# EAGLE design ArduinoRadioV1 (EAGLE 9.5.2)
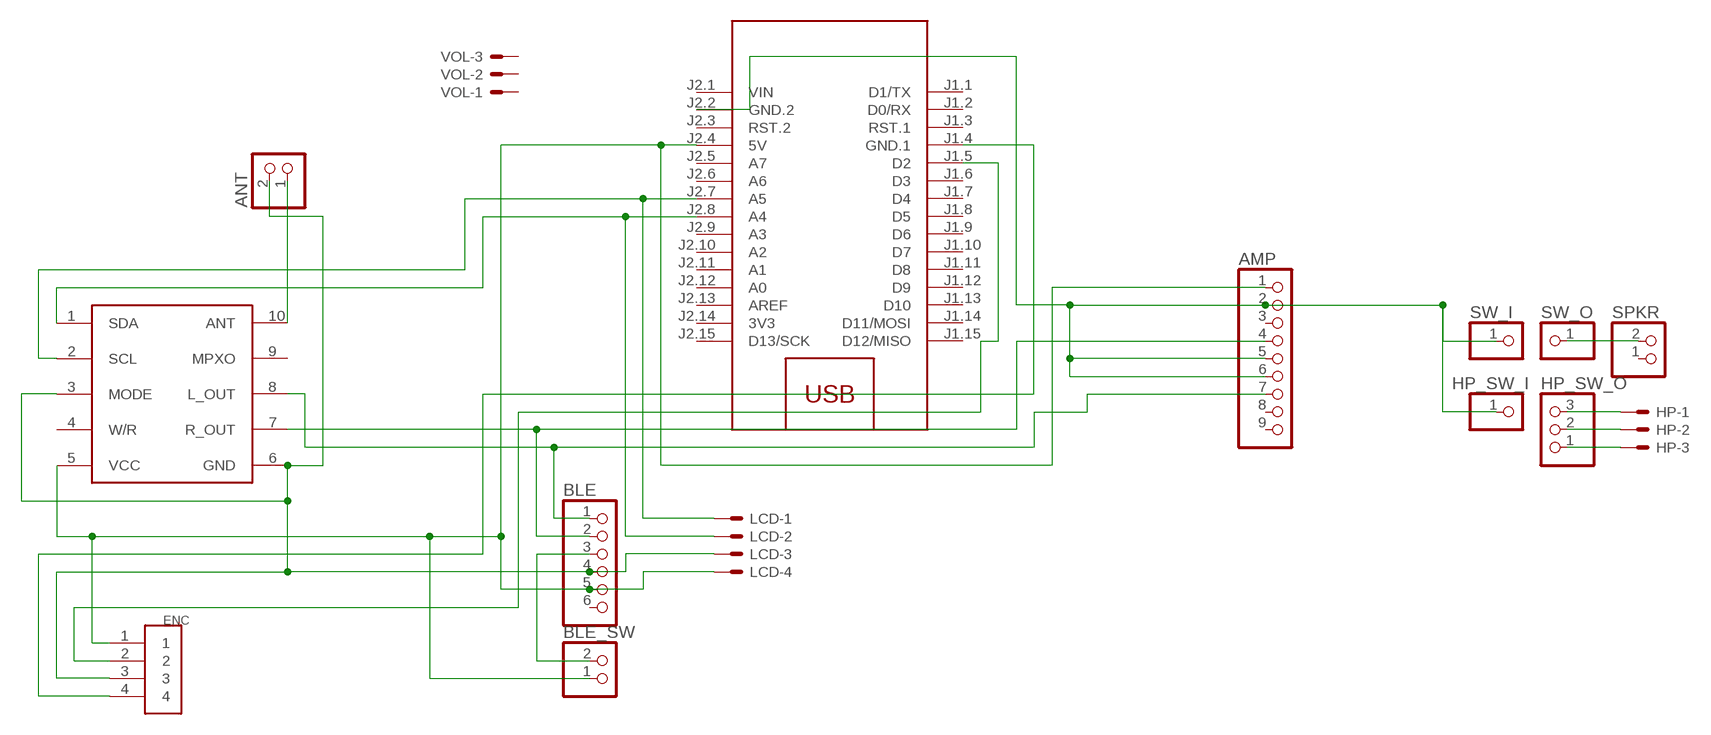
[diagram p0: schematic, sheet 1]

## Parts
AMP  PINHD-1X9  [1X09-BIG]
ANT  JST_2PIN-THM  [JST-PH-2-THM]
BLE  PINHD-1X6  [1X06]
BLE_SW  JST_2PIN-THM  [JST-PH-2-THM]
ENC  1X4-BIG  [1X04-BIG]
HP  JST-XH-03-PIN-ROUND-PAD  [JST-XH-03-PACKAGE-ROUND-PAD]
HP_SW_I  PINHD-1X1  [1X01]
HP_SW_O  PINHD-1X3  [1X03]
LCD  JST-XH-04-PIN-ROUND-PAD  [JST-XH-04-PACKAGE-ROUND-PAD]
M1  ARDUINO-NANO-3.0  [ARDUINO-NANO-3.0]
SPKR  JST_2PIN-THM  [JST-PH-2-THM]
SW_I  PINHD-1X1  [1X01]
SW_O  PINHD-1X1  [1X01]
TEA5767  TEA5767BREAKOUT  [TEA5767MM2]
VOL  JST-XH-03-PIN-ROUND-PAD  [JST-XH-03-PACKAGE-ROUND-PAD]

## Nets
ANT: ANT.1 TEA5767.10(ANT)
D2: ENC.2 M1.J1.5(D2)
GND: ANT.2 BLE.4 ENC.3 LCD.3 TEA5767.3(MODE) TEA5767.6(GND)
HP_GND: HP.1 HP_SW_O.3
L: HP.3 HP_SW_O.1
L_OUT: AMP.7 BLE.1 TEA5767.8(L_OUT)
N$1: SPKR.2 SW_O.1
N$2: BLE.3 BLE_SW.2
N$6: ENC.4 M1.J1.4(GND.1)
R: HP.2 HP_SW_O.2
R_OUT: AMP.2 AMP.4 AMP.5 AMP.6 BLE.2 HP_SW_I.1 M1.J2.2(GND.2) SW_I.1 TEA5767.7(R_OUT)
SCL: LCD.1 M1.J2.7(A5) TEA5767.2(SCL)
SDA: LCD.2 M1.J2.8(A4) TEA5767.1(SDA)
VCC: AMP.1 BLE.5 BLE_SW.1 ENC.1 LCD.4 M1.J2.4(5V) TEA5767.5(VCC)
Unconnected: AMP.3 AMP.8 AMP.9 BLE.6 M1.J1.1(D1/TX) M1.J1.2(D0/RX) M1.J1.3(RST.1) M1.J1.6(D3) M1.J1.7(D4) M1.J1.8(D5) M1.J1.9(D6) M1.J1.10(D7) M1.J1.11(D8) M1.J1.12(D9) M1.J1.13(D10) M1.J1.14(D11/MOSI) M1.J1.15(D12/MISO) M1.J2.3(RST.2) M1.J2.5(A7) M1.J2.6(A6) M1.J2.9(A3) M1.J2.10(A2) M1.J2.11(A1) M1.J2.12(A0) M1.J2.13(AREF) M1.J2.15(D13/SCK) SPKR.1 TEA5767.4(W/R) TEA5767.9(MPXO) VOL.1 VOL.2 VOL.3

## Power pins joined to a net without a drawn wire
3V3: M1.J2.14(3V3)
VIN: M1.J2.1(VIN)

## Library data of the parts
AMP = adafruit:PINHD-1X9: Pin header 1x10 0.1" spacing With round pins
ANT BLE_SW SPKR = adafruit:JST_2PIN: JST 2-Pin Connectors of various flavors SMT-RA (S2B-PH-SM4) 4UConnector #17311 SMT (B2B-PH-SM4) THM-RA (S2B-PH) THM (B2B-PH)
BLE = adafruit:PINHD-1X6: PIN HEADER
ENC = adafruit:1X4: 4-pin connector
HP VOL = Rembrandt Electronics - JST XH Connectors v1-0:JST-XH-03-PIN: JST XH Connector 2 Pin Wire to board connector. Pitch: 2,54 mm, (0.100") Number of pins: 3 Created by Rembrandt Electronics www.rembrandtelectronics.com
HP_SW_I SW_I SW_O = adafruit:PINHD-1X1: Pin header 1x1 for 0.1" spacing With round pins
HP_SW_O = adafruit:PINHD-1X3: PIN HEADER
LCD = Rembrandt Electronics - JST XH Connectors v1-0:JST-XH-04-PIN: JST XH Connector 2 Pin Wire to board connector. Pitch: 2,54 mm, (0.100") Number of pins: 4 Created by Rembrandt Electronics www.rembrandtelectronics.com
M1 = diy-modules:ARDUINO-NANO-3.0: Arduino Nano 3.0 and compatible devices More details available here: https://www.arduino.cc/en/Main/ArduinoBoardNano Click here to find device on ebay.com <http://www.ebay.com/sch/arduino+nano>
TEA5767 = MyParts:TEA5767BREAKOUT

## Board
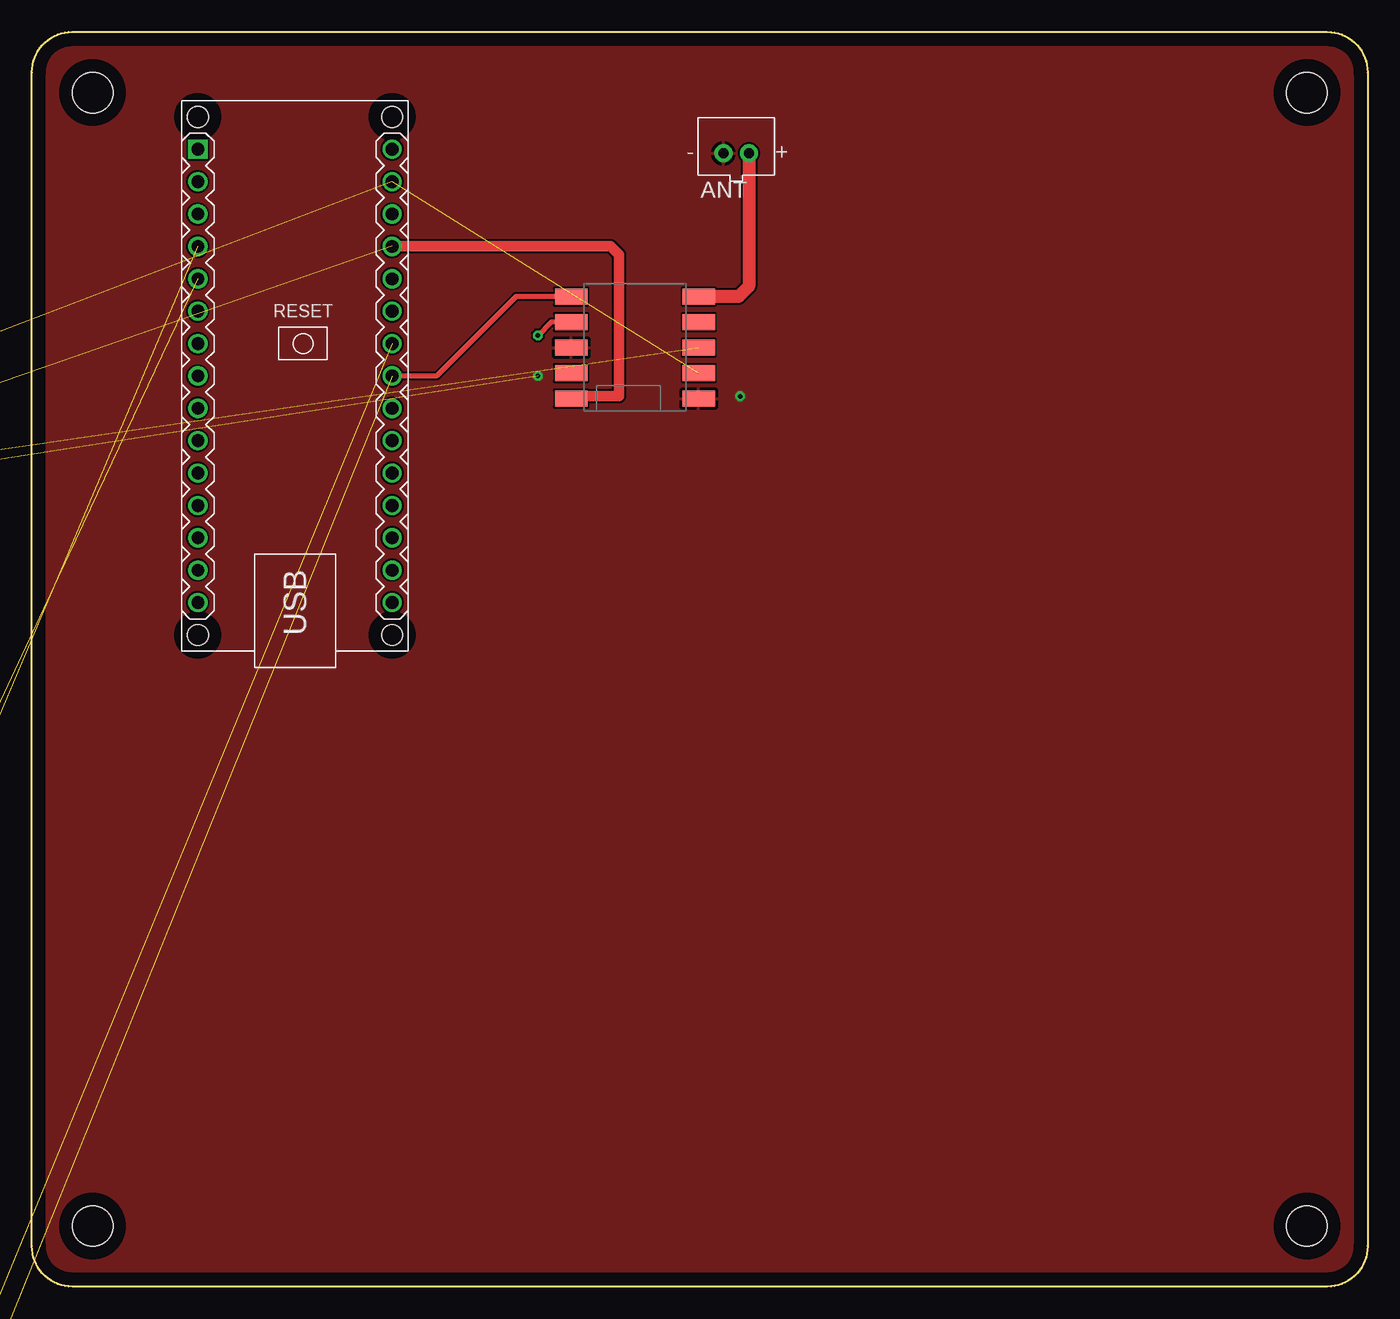
[diagram p1: board, top side]
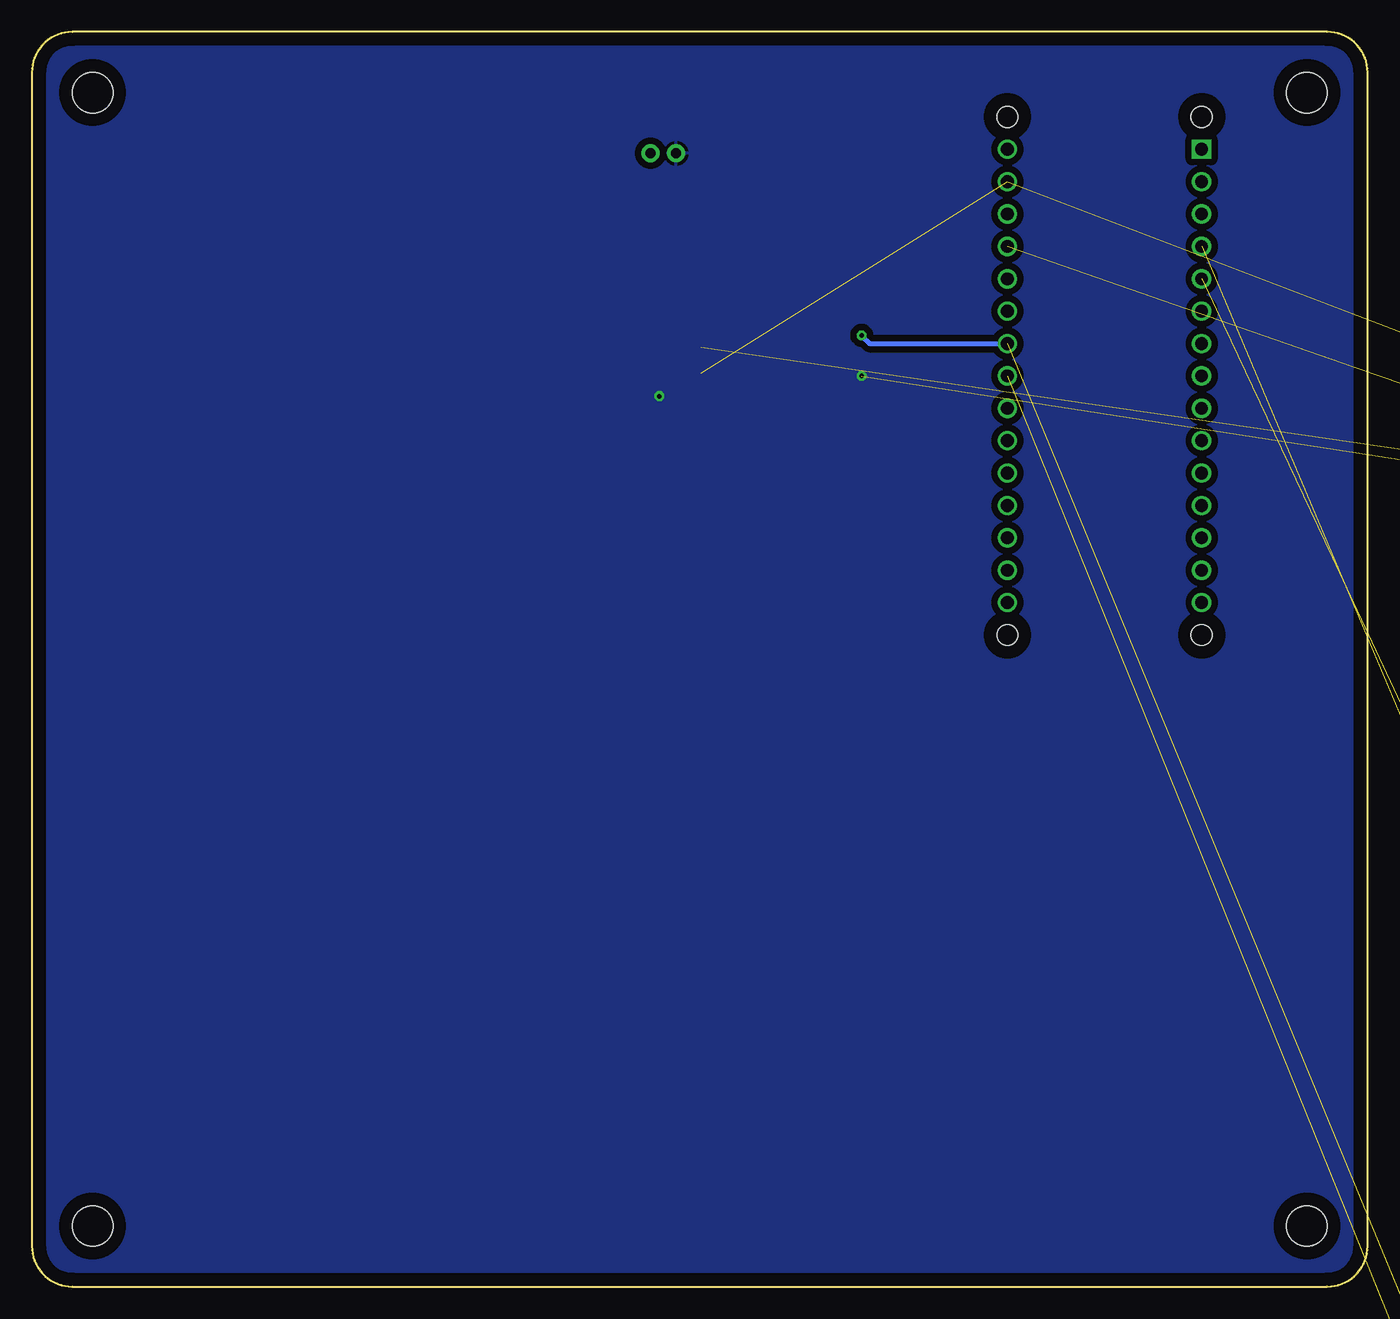
[diagram p2: board, bottom side, seen from below]

Size 104.78 x 98.42 mm. Coordinates in mm from the lower left corner, seen from the top.
Outline: 101.6,0 3.17,0 arc-90 0,3.18 0,95.25 arc-90 3.17,98.43 101.6,98.43 arc-90 104.78,95.25 104.78,3.18 arc-90 101.6,0
Copper layers (1*16): Top 0.035mm / dielectric 1.5mm / Bottom 0.035mm
Design rules "default": minimum track width 6mil, minimum drill 0.35mm, track to track 6mil, track to pad 6mil, pad to pad 6mil, via to via 6mil, smd to smd 6mil, copper to edge 40mil, drill to drill 6mil, minimum pad ring 10mil, minimum via ring 8mil, stop-mask expansion 4mil, vias tented up to drill 0mil, thermal gap 10mil
Holes 3.17 mm at 4.76,4.76 100.01,4.76 4.76,93.66 100.01,93.66

### Footprints (pad centres in the part's own frame; a part is rotated, then mirrored left to right if it is on the bottom)
1X09-BIG = drill 1.016 pad 1.778 octagon: 1 -10.16,0; 2 -7.62,0; 3 -5.08,0; 4 -2.54,0; 5 0,0; 6 2.54,0; 7 5.08,0; 8 7.62,0; 9 10.16,0
JST-PH-2-THM = drill 0.8 pad 1.422: 1 1,0; 2 -1,0
1X06 = drill 1.016 octagon: 1 -6.35,0; 2 -3.81,0; 3 -1.27,0; 4 1.27,0; 5 3.81,0; 6 6.35,0
1X04-BIG = drill 1.016 pad 1.778: 1 0,0; 2 2.54,0; 3 5.08,0; 4 7.62,0
JST-XH-03-PACKAGE-ROUND-PAD = drill 1.016: 1 -2.54,0; 2 0,0; 3 2.54,0
1X01 = drill 1.016 pad 1.93 octagon: 1 0,0
1X03 = drill 1.016: 1 -2.54,0; 2 0,0; 3 2.54,0
JST-XH-04-PACKAGE-ROUND-PAD = drill 1.016: 1 -3.81,0; 2 -1.27,0; 3 1.27,0; 4 3.81,0
ARDUINO-NANO-3.0 = drill 1 square: J1.1 17.78,7.62 | drill 1: J1.2 15.24,7.62; J1.3 12.7,7.62; J1.4 10.16,7.62; J1.5 7.62,7.62; J1.6 5.08,7.62; J1.7 2.54,7.62; J1.8 0,7.62; J1.9 -2.54,7.62; J1.10 -5.08,7.62; J1.11 -7.62,7.62; J1.12 -10.16,7.62; J1.13 -12.7,7.62; J1.14 -15.24,7.62; J1.15 -17.78,7.62; J2.1 17.78,-7.62; J2.2 15.24,-7.62; J2.3 12.7,-7.62; J2.4 10.16,-7.62; J2.5 7.62,-7.62; J2.6 5.08,-7.62; J2.7 2.54,-7.62; J2.8 0,-7.62; J2.9 -2.54,-7.62; J2.10 -5.08,-7.62; J2.11 -7.62,-7.62; J2.12 -10.16,-7.62; J2.13 -12.7,-7.62; J2.14 -15.24,-7.62; J2.15 -17.78,-7.62 | hole 1.651: -20.32,7.62; -20.32,-7.62; 20.32,-7.62; 20.32,7.62
TEA5767MM2 = smd 2.54 x 1.27: 1 -5,4; 2 -5,2; 3 -5,0; 4 -5,-2; 5 -5,-4; 6 5,-4; 7 5,-2; 8 5,0; 9 5,2; 10 5,4

### Placement (x,y rotation side)
AMP  -42.86,-65.09 0 top  (outside the outline)
ANT  55.24,88.9 0 top
BLE  -39.37,59.37 0 top  (outside the outline)
BLE_SW  -50.8,-50.8 0 top  (outside the outline)
ENC  -53.98,-58.74 0 top  (outside the outline)
HP  -47.62,-92.08 0 top  (outside the outline)
HP_SW_I  -53.98,-98.43 0 top  (outside the outline)
HP_SW_O  -50.8,-111.12 0 top  (outside the outline)
LCD  -47.62,-119.06 0 top  (outside the outline)
M1  20.64,71.44 90 top
SPKR  -50.8,-69.85 0 top  (outside the outline)
SW_I  -53.98,-77.79 0 top  (outside the outline)
SW_O  -53.98,-84.14 0 top  (outside the outline)
TEA5767  47.31,73.66 0 top
VOL  -47.62,-127 0 top  (outside the outline)

### Tracks (layer width: path | path; a pad name or v marks a point on that pad's centre or on a via)
ANT
  Top 1.016: ANT.1 56.24,78.47 55.44,77.66 TEA5767.10
D2  (1 unrouted)
GND  (via drill 0.35)  (3 unrouted)
  other vias: 39.69,71.44 55.56,69.85
  pour Bottom (isolate 0.508): 0,95.25 arc-90 3.17,98.42 101.6,98.42 arc-90 104.78,95.25 104.78,3.18 arc-90 101.6,0 3.17,0 arc-90 0,3.18
  pour Top: 101.6,0 3.17,0 arc-90 0,3.18 0,95.25 arc-90 3.17,98.42 101.6,98.42 arc-90 104.78,95.25 104.78,3.18 arc-90
HP_GND  (1 unrouted)
L  (1 unrouted)
L_OUT  (2 unrouted)
N$1  (1 unrouted)
N$2  (1 unrouted)
N$6  (1 unrouted)
R  (1 unrouted)
R_OUT  (8 unrouted)
SCL  (via drill 0.35)  (1 unrouted)
  Top 0.406: TEA5767.2 40.73,75.66 v39.69,74.61
  Bottom 0.406: v39.69,74.61 39.05,73.98 M1.J2.7
SDA  (1 unrouted)
  Top 0.406: TEA5767.1 37.97,77.66 31.75,71.44 M1.J2.8
VCC  (5 unrouted)
  Top 0.813: 42.12,69.85 TEA5767.5 42.5,69.85 46.04,69.85 46.04,80.96 45.4,81.6 M1.J2.4